# EAGLE schematic qc board V3 (EAGLE 9.6.1)
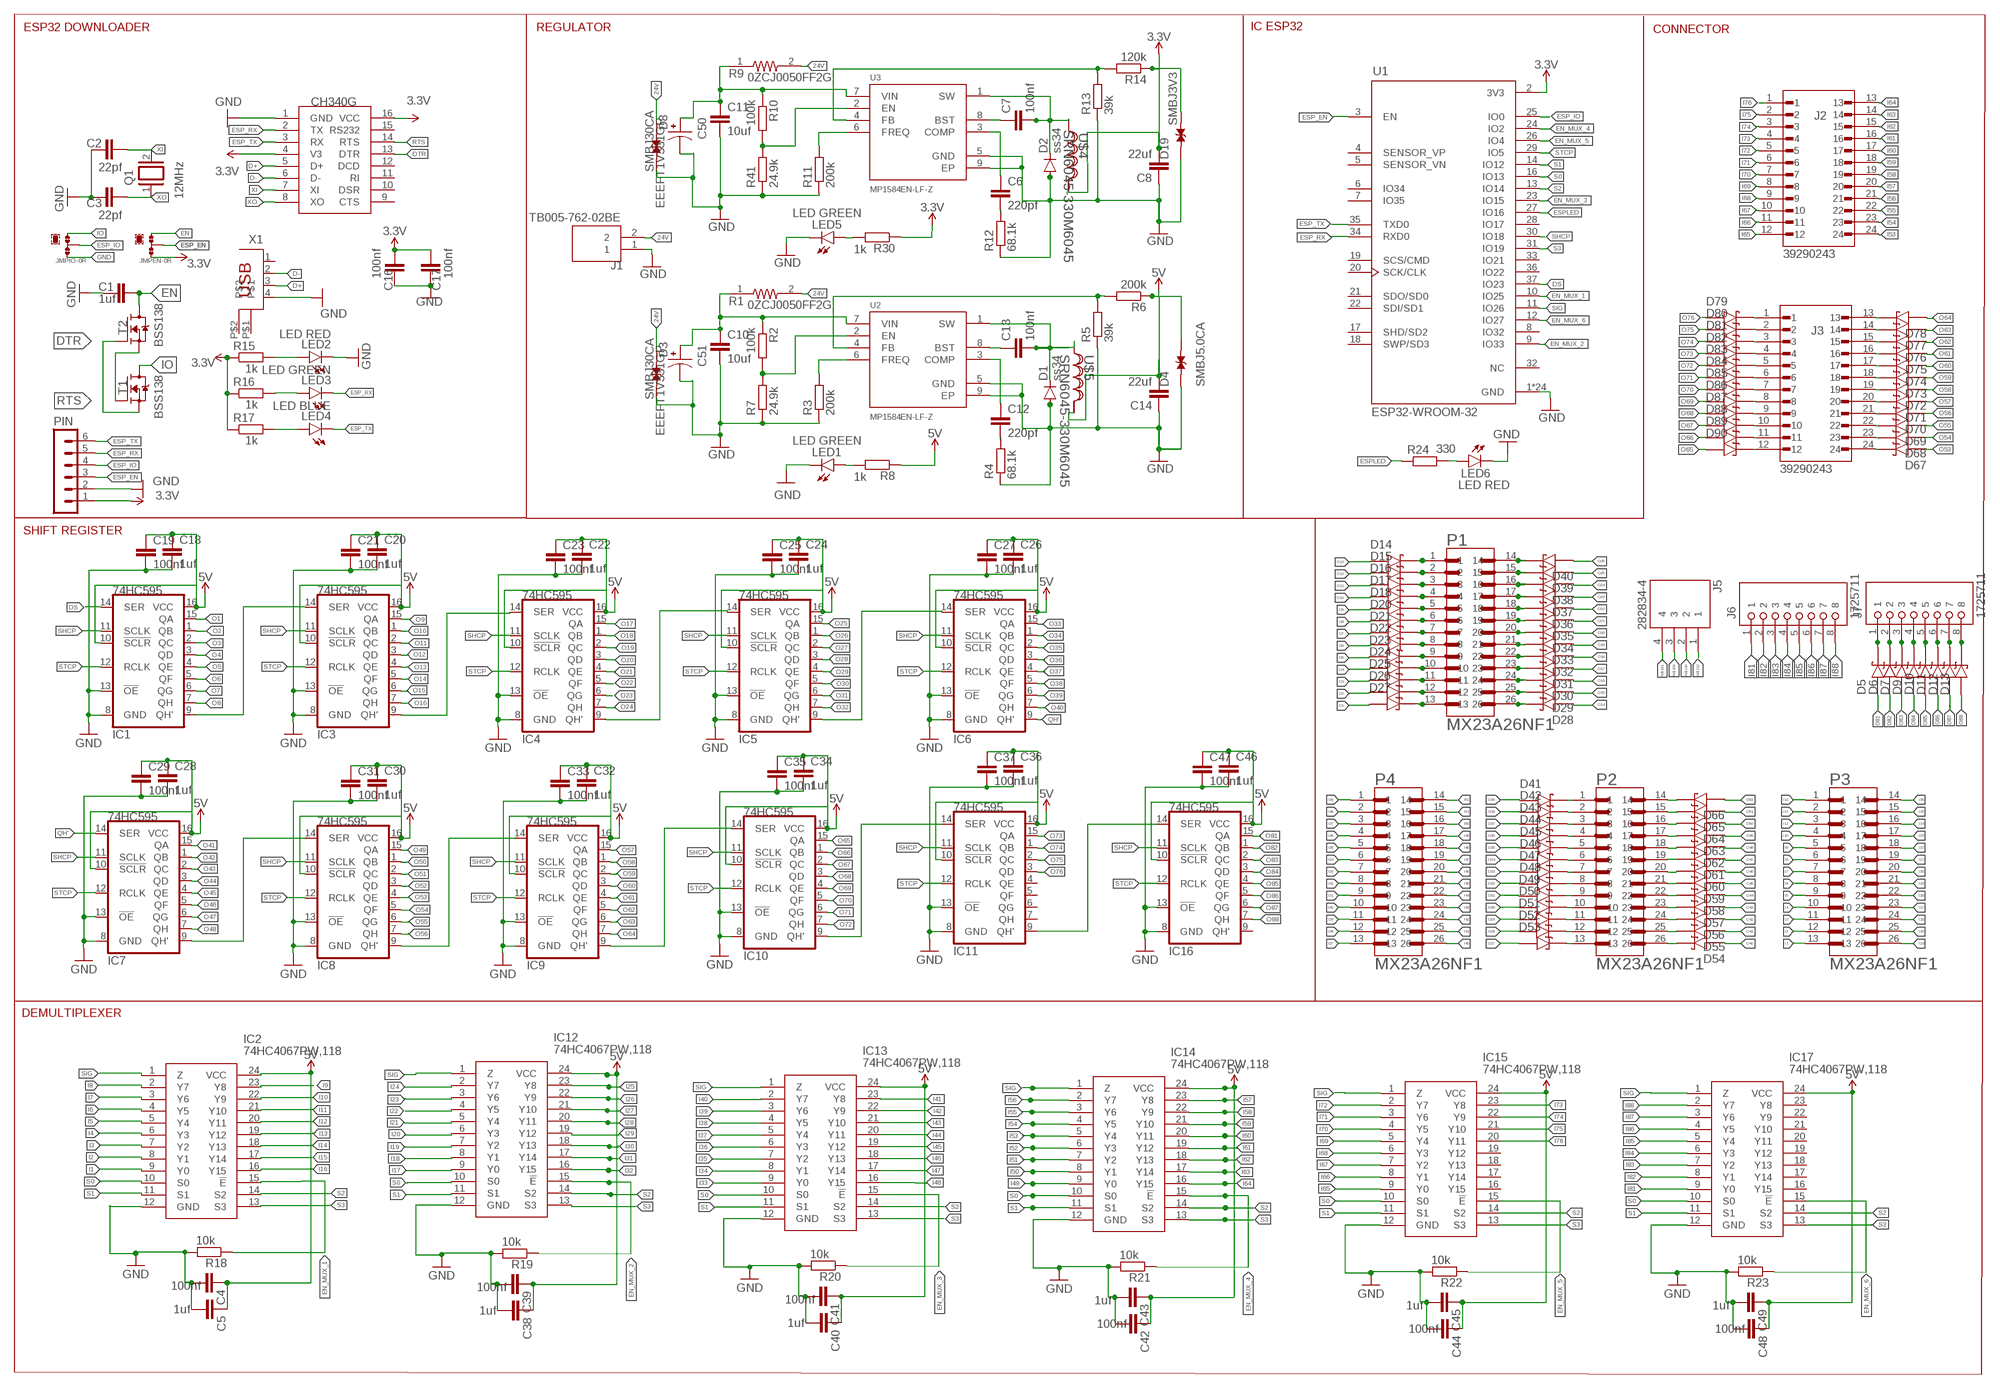
[diagram p0: schematic, sheet 1]

## Parts
C1  1uf  C-EUC0805  [C0805]
C2  22pf  C-EUC0805  [C0805]
C3  22pf  C-EUC0805  [C0805]
C4  100nf  C-EUC0805  [C0805]
C5  1uf  C-EUC0805  [C0805]
C6  220pf  C-EUC0805  [C0805]
C7  100nf  C-EUC0805  [C0805]
C8  22uf  C-EUC0805  [C0805]
C10  10uf  C-EUC0805  [C0805]
C11  10uf  C-EUC0805  [C0805]
C12  220pf  C-EUC0805  [C0805]
C13  100nf  C-EUC0805  [C0805]
C14  22uf  C-EUC0805  [C0805]
C16  100nf  C-EUC0805  [C0805]
C17  100nf  C-EUC0805  [C0805]
C18  1uf  C-EUC0805  [C0805]
C19  100nf  C-EUC0805  [C0805]
C20  1uf  C-EUC0805  [C0805]
C21  100nf  C-EUC0805  [C0805]
C22  1uf  C-EUC0805  [C0805]
C23  100nf  C-EUC0805  [C0805]
C24  1uf  C-EUC0805  [C0805]
C25  100nf  C-EUC0805  [C0805]
C26  1uf  C-EUC0805  [C0805]
C27  100nf  C-EUC0805  [C0805]
C28  1uf  C-EUC0805  [C0805]
C29  100nf  C-EUC0805  [C0805]
C30  1uf  C-EUC0805  [C0805]
C31  100nf  C-EUC0805  [C0805]
C32  1uf  C-EUC0805  [C0805]
C33  100nf  C-EUC0805  [C0805]
C34  1uf  C-EUC0805  [C0805]
C35  100nf  C-EUC0805  [C0805]
C36  1uf  C-EUC0805  [C0805]
C37  100nf  C-EUC0805  [C0805]
C38  1uf  C-EUC0805  [C0805]
C39  100nf  C-EUC0805  [C0805]
C40  1uf  C-EUC0805  [C0805]
C41  100nf  C-EUC0805  [C0805]
C42  100nf  C-EUC0805  [C0805]
C43  1uf  C-EUC0805  [C0805]
C44  100nf  C-EUC0805  [C0805]
C45  1uf  C-EUC0805  [C0805]
C46  1uf  C-EUC0805  [C0805]
C47  100nf  C-EUC0805  [C0805]
C48  100nf  C-EUC0805  [C0805]
C49  1uf  C-EUC0805  [C0805]
C50  EEEFT1V331GP  [CAP_EEEFT1V331GP]
C51  EEEFT1V331GP  [CAP_EEEFT1V331GP]
D1  ss34  DIODE-SMB  [SMB]
D2  ss34  DIODE-SMB  [SMB]
D3  SMBJ30CA  [DIOM4336X265N]
D4  SMBJ5.0CA  [DIOM4336X265N]
D5  1N5819HW-7  [SOD3715X145N]
D6  1N5819HW-7  [SOD3715X145N]
D7  1N5819HW-7  [SOD3715X145N]
D8  SMBJ30CA  [DIOM4336X265N]
D9  1N5819HW-7  [SOD3715X145N]
D10  1N5819HW-7  [SOD3715X145N]
D11  1N5819HW-7  [SOD3715X145N]
D12  1N5819HW-7  [SOD3715X145N]
D13  1N5819HW-7  [SOD3715X145N]
D14  1N5819HW-7  [SOD3715X145N]
D15  1N5819HW-7  [SOD3715X145N]
D16  1N5819HW-7  [SOD3715X145N]
D17  1N5819HW-7  [SOD3715X145N]
D18  1N5819HW-7  [SOD3715X145N]
D19  SMBJ3V3  [DIOM4336X265N]
D20  1N5819HW-7  [SOD3715X145N]
D21  1N5819HW-7  [SOD3715X145N]
D22  1N5819HW-7  [SOD3715X145N]
D23  1N5819HW-7  [SOD3715X145N]
D24  1N5819HW-7  [SOD3715X145N]
D25  1N5819HW-7  [SOD3715X145N]
D26  1N5819HW-7  [SOD3715X145N]
D27  1N5819HW-7  [SOD3715X145N]
D28  1N5819HW-7  [SOD3715X145N]
D29  1N5819HW-7  [SOD3715X145N]
D30  1N5819HW-7  [SOD3715X145N]
D31  1N5819HW-7  [SOD3715X145N]
D32  1N5819HW-7  [SOD3715X145N]
D33  1N5819HW-7  [SOD3715X145N]
D34  1N5819HW-7  [SOD3715X145N]
D35  1N5819HW-7  [SOD3715X145N]
D36  1N5819HW-7  [SOD3715X145N]
D37  1N5819HW-7  [SOD3715X145N]
D38  1N5819HW-7  [SOD3715X145N]
D39  1N5819HW-7  [SOD3715X145N]
D40  1N5819HW-7  [SOD3715X145N]
D41  1N5819HW-7  [SOD3715X145N]
D42  1N5819HW-7  [SOD3715X145N]
D43  1N5819HW-7  [SOD3715X145N]
D44  1N5819HW-7  [SOD3715X145N]
D45  1N5819HW-7  [SOD3715X145N]
D46  1N5819HW-7  [SOD3715X145N]
D47  1N5819HW-7  [SOD3715X145N]
D48  1N5819HW-7  [SOD3715X145N]
D49  1N5819HW-7  [SOD3715X145N]
D50  1N5819HW-7  [SOD3715X145N]
D51  1N5819HW-7  [SOD3715X145N]
D52  1N5819HW-7  [SOD3715X145N]
D53  1N5819HW-7  [SOD3715X145N]
D54  1N5819HW-7  [SOD3715X145N]
D55  1N5819HW-7  [SOD3715X145N]
D56  1N5819HW-7  [SOD3715X145N]
D57  1N5819HW-7  [SOD3715X145N]
D58  1N5819HW-7  [SOD3715X145N]
D59  1N5819HW-7  [SOD3715X145N]
D60  1N5819HW-7  [SOD3715X145N]
D61  1N5819HW-7  [SOD3715X145N]
D62  1N5819HW-7  [SOD3715X145N]
D63  1N5819HW-7  [SOD3715X145N]
D64  1N5819HW-7  [SOD3715X145N]
D65  1N5819HW-7  [SOD3715X145N]
D66  1N5819HW-7  [SOD3715X145N]
D67  1N5819HW-7  [SOD3715X145N]
D68  1N5819HW-7  [SOD3715X145N]
D69  1N5819HW-7  [SOD3715X145N]
D70  1N5819HW-7  [SOD3715X145N]
D71  1N5819HW-7  [SOD3715X145N]
D72  1N5819HW-7  [SOD3715X145N]
D73  1N5819HW-7  [SOD3715X145N]
D74  1N5819HW-7  [SOD3715X145N]
D75  1N5819HW-7  [SOD3715X145N]
D76  1N5819HW-7  [SOD3715X145N]
D77  1N5819HW-7  [SOD3715X145N]
D78  1N5819HW-7  [SOD3715X145N]
D79  1N5819HW-7  [SOD3715X145N]
D80  1N5819HW-7  [SOD3715X145N]
D81  1N5819HW-7  [SOD3715X145N]
D82  1N5819HW-7  [SOD3715X145N]
D83  1N5819HW-7  [SOD3715X145N]
D84  1N5819HW-7  [SOD3715X145N]
D85  1N5819HW-7  [SOD3715X145N]
D86  1N5819HW-7  [SOD3715X145N]
D87  1N5819HW-7  [SOD3715X145N]
D88  1N5819HW-7  [SOD3715X145N]
D89  1N5819HW-7  [SOD3715X145N]
D90  1N5819HW-7  [SOD3715X145N]
IC1  74HC595  [SO16]
IC2  74HC4067PW,118  [SOP65P640X110-24N]
IC3  74HC595  [SO16]
IC4  74HC595  [SO16]
IC5  74HC595  [SO16]
IC6  74HC595  [SO16]
IC7  74HC595  [SO16]
IC8  74HC595  [SO16]
IC9  74HC595  [SO16]
IC10  74HC595  [SO16]
IC11  74HC595  [SO16]
IC12  74HC4067PW,118  [SOP65P640X110-24N]
IC13  74HC4067PW,118  [SOP65P640X110-24N]
IC14  74HC4067PW,118  [SOP65P640X110-24N]
IC15  74HC4067PW,118  [SOP65P640X110-24N]
IC16  74HC595  [SO16]
IC17  74HC4067PW,118  [SOP65P640X110-24N]
J1  TB005-762-02BE  [CUI_TB005-762-02BE]
J2  39290243  [MOLEX_39290243]
J3  39290243  [MOLEX_39290243]
J5  282834-4  [TE_282834-4]
J6  1725711  [PHOENIX_1725711]
J7  1725711  [PHOENIX_1725711]
JMPEN  0R-JUMPB  [B0R-JMP]
JMPIO  0R-JUMPB  [B0R-JMP]
LED1  LED GREEN  LEDCHIP-LED0805  [CHIP-LED0805]
LED2  LED RED  LEDCHIPLED_0805  [CHIPLED_0805]
LED3  LED GREEN  LEDCHIPLED_0805  [CHIPLED_0805]
LED4  LED BLUE  LEDCHIPLED_0805  [CHIPLED_0805]
LED5  LED GREEN  LEDCHIP-LED0805  [CHIP-LED0805]
LED6  LED RED  LEDCHIP-LED0805  [CHIP-LED0805]
P1  MX23A26NF1  [JAE_MX23A26NF1]
P2  MX23A26NF1  [JAE_MX23A26NF1]
P3  MX23A26NF1  [JAE_MX23A26NF1]
P4  MX23A26NF1  [JAE_MX23A26NF1]
PIN  MA06-1  [MA06-1]
Q1  12MHz  XTAL/S  [QS]
R1  0ZCJ0050FF2G  [RESC3216X125N]
R2  100k  R-EU_R0805  [R0805]
R3  200k  R-EU_R0805  [R0805]
R4  68.1k  R-EU_R0805  [R0805]
R5  39k  R-EU_R0805  [R0805]
R6  200k  R-EU_R0805  [R0805]
R7  24.9k  R-EU_R0805  [R0805]
R8  1k  R-EU_R0805  [R0805]
R9  0ZCJ0050FF2G  [RESC3216X125N]
R10  100k  R-EU_R0805  [R0805]
R11  200k  R-EU_R0805  [R0805]
R12  68.1k  R-EU_R0805  [R0805]
R13  39k  R-EU_R0805  [R0805]
R14  120k  R-EU_R0805  [R0805]
R15  1k  R-EU_M0805  [M0805]
R16  1k  R-EU_M0805  [M0805]
R17  1k  R-EU_M0805  [M0805]
R18  10k  R-EU_M0805  [M0805]
R19  10k  R-EU_M0805  [M0805]
R20  10k  R-EU_M0805  [M0805]
R21  10k  R-EU_M0805  [M0805]
R22  10k  R-EU_M0805  [M0805]
R23  10k  R-EU_M0805  [M0805]
R24  330  R-EU_R0805  [R0805]
R30  1k  R-EU_R0805  [R0805]
R41  24.9k  R-EU_R0805  [R0805]
T1  BSS138  [SOT95P240X111-3N]
T2  BSS138  [SOT95P240X111-3N]
U1  ESP32-WROOM-32  [MODULE_ESP32-WROOM-32]
U2  MP1584EN-LF-Z  [SOIC127P600X170-9N]
U3  MP1584EN-LF-Z  [SOIC127P600X170-9N]
U$3  CH340G  [SOIC16]
U$4  SRN6045-330M6045  [SRN6045]
U$5  SRN6045-330M6045  [SRN6045]
X1  PN61729  [PN61729]

## Nets
3.3V: C8.2 C16.1 C17.1 D19.2 JMPEN.3 PIN.1 R14.1 R15.1 R16.1 R17.1 R30.1 U1.2(3V3) U$3.4(V3) U$3.16(VCC) U$4.1
5V: C4.1 C5.1 C14.2 C18.1 C19.1 C20.1 C21.1 C22.1 C23.1 C24.1 C25.1 C26.1 C27.1 C28.1 C29.1 C30.1 C31.1 C32.1 C33.1 C34.1 C35.1 C36.1 C37.1 C38.1 C39.1 C40.1 C41.1 C42.1 C43.1 C44.1 C45.1 C46.1 C47.1 C48.1 C49.1 D4.2 IC1.10(!SCLR) IC1.16(VCC) IC2.24(VCC) IC3.10(!SCLR) IC3.16(VCC) IC4.10(!SCLR) IC4.16(VCC) IC5.10(!SCLR) IC5.16(VCC) IC6.10(!SCLR) IC6.16(VCC) IC7.10(!SCLR) IC7.16(VCC) IC8.10(!SCLR) IC8.16(VCC) IC9.10(!SCLR) IC9.16(VCC) IC10.10(!SCLR) IC10.16(VCC) IC11.10(!SCLR) IC11.16(VCC) IC12.24(VCC) IC13.24(VCC) IC14.24(VCC) IC15.24(VCC) IC16.10(!SCLR) IC16.16(VCC) IC17.24(VCC) R6.1 R8.1 U$5.1
24V: D3.1 D8.1 J1.2 R1.2 R9.2
D+: U$3.5(D+) X1.3
D-: U$3.6(D-) X1.2
DS: IC1.14(SER) U1.37(IO23)
DTR: T1.2(S) T2.1(G) U$3.13(DTR)
EN: C1.1 JMPEN.1 T2.3(D)
EN_MUX_1: IC2.15(!E) R18.1 U1.10(IO25)
EN_MUX_2: IC12.15(!E) R19.1 U1.9(IO33)
EN_MUX_3: IC13.15(!E) R20.1 U1.23(IO15)
EN_MUX_4: IC14.15(!E) R21.1 U1.24(IO2)
EN_MUX_5: IC15.15(!E) R22.1 U1.26(IO4)
EN_MUX_6: IC17.15(!E) R23.1 U1.12(IO27)
ESP_EN: JMPEN.2 PIN.3 U1.3(EN)
ESP_IO: JMPIO.2 PIN.4 U1.25(IO0)
ESP_RX: LED3.C PIN.5 U1.34(RXD0) U$3.2(TX)
ESP_TX: LED4.C PIN.6 U1.35(TXD0) U$3.3(RX)
ESPLED: R24.1 U1.27(IO16)
GND: C1.2 C2.2 C3.2 C4.2 C5.2 C8.1 C10.2 C11.2 C14.1 C16.2 C17.2 C18.2 C19.2 C20.2 C21.2 C22.2 C23.2 C24.2 C25.2 C26.2 C27.2 C28.2 C29.2 C30.2 C31.2 C32.2 C33.2 C34.2 C35.2 C36.2 C37.2 C38.2 C39.2 C40.2 C41.2 C42.2 C43.2 C44.2 C45.2 C46.2 C47.2 C48.2 C49.2 C50.2 C51.2 D1.A D2.A D3.2 D4.1 D8.2 D19.1 IC1.8(GND) IC1.13(!OE) IC2.12(GND) IC3.8(GND) IC3.13(!OE) IC4.8(GND) IC4.13(!OE) IC5.8(GND) IC5.13(!OE) IC6.8(GND) IC6.13(!OE) IC7.8(GND) IC7.13(!OE) IC8.8(GND) IC8.13(!OE) IC9.8(GND) IC9.13(!OE) IC10.8(GND) IC10.13(!OE) IC11.8(GND) IC11.13(!OE) IC12.12(GND) IC13.12(GND) IC14.12(GND) IC15.12(GND) IC16.8(GND) IC16.13(!OE) IC17.12(GND) J1.1 JMPIO.3 LED1.C LED2.C LED5.C LED6.C PIN.2 R3.1 R4.1 R5.1 R7.1 R11.1 R12.1 R13.1 R18.2 R19.2 R20.2 R21.2 R22.2 R23.2 R41.1 U1.1(GND) U1.15(GND) U1.38(GND) U1.39_1(GND) U1.39_2(GND) U1.39_3(GND) U1.39_4(GND) U1.39_5(GND) U1.39_6(GND) U1.39_7(GND) U1.39_8(GND) U1.39_9(GND) U1.39_10(GND) U1.39_11(GND) U1.39_12(GND) U1.39_13(GND) U1.39_14(GND) U1.39_15(GND) U1.39_16(GND) U1.39_17(GND) U1.39_18(GND) U1.39_19(GND) U1.39_20(GND) U1.39_21(GND) U2.5(GND) U2.9(EP) U3.5(GND) U3.9(EP) U$3.1(GND) X1.4
I1: IC2.9(Y0) P3.13
I2: IC2.8(Y1) P3.12
I3: IC2.7(Y2) P3.11
I4: IC2.6(Y3) P3.10
I5: IC2.5(Y4) P3.9
I6: IC2.4(Y5) P3.8
I7: IC2.3(Y6) P3.7
I8: IC2.2(Y7) P3.6
I9: IC2.23(Y8) P3.5
I10: IC2.22(Y9) P3.4
I11: IC2.21(Y10) P3.3
I12: IC2.20(Y11) P3.2
I13: IC2.19(Y12) P3.1
I14: IC2.18(Y13) P3.26
I15: IC2.17(Y14) P3.25
I16: IC2.16(Y15) P3.24
I17: IC12.9(Y0) P3.23
I18: IC12.8(Y1) P3.22
I19: IC12.7(Y2) P3.21
I20: IC12.6(Y3) P3.20
I21: IC12.5(Y4) P3.19
I22: IC12.4(Y5) P3.18
I23: IC12.3(Y6) P3.17
I24: IC12.2(Y7) P3.16
I25: IC12.23(Y8) P3.15
I26: IC12.22(Y9) P3.14
I27: IC12.21(Y10) P4.13
I28: IC12.20(Y11) P4.12
I29: IC12.19(Y12) P4.11
I30: IC12.18(Y13) P4.10
I31: IC12.17(Y14) P4.9
I32: IC12.16(Y15) P4.8
I33: IC13.9(Y0) P4.7
I34: IC13.8(Y1) P4.6
I35: IC13.7(Y2) P4.5
I36: IC13.6(Y3) P4.4
I37: IC13.5(Y4) P4.3
I38: IC13.4(Y5) P4.2
I39: IC13.3(Y6) P4.1
I40: IC13.2(Y7) P4.26
I41: IC13.23(Y8) P4.25
I42: IC13.22(Y9) P4.24
I43: IC13.21(Y10) P4.23
I44: IC13.20(Y11) P4.22
I45: IC13.19(Y12) P4.21
I46: IC13.18(Y13) P4.20
I47: IC13.17(Y14) P4.19
I48: IC13.16(Y15) P4.18
I49: IC14.9(Y0) P4.17
I50: IC14.8(Y1) P4.16
I51: IC14.7(Y2) P4.15
I52: IC14.6(Y3) P4.14
I53: IC14.5(Y4) J2.24
I54: IC14.4(Y5) J2.23
I55: IC14.3(Y6) J2.22
I56: IC14.2(Y7) J2.21
I57: IC14.23(Y8) J2.20
I58: IC14.22(Y9) J2.19
I59: IC14.21(Y10) J2.18
I60: IC14.20(Y11) J2.17
I61: IC14.19(Y12) J2.16
I62: IC14.18(Y13) J2.15
I63: IC14.17(Y14) J2.14
I64: IC14.16(Y15) J2.13
I65: IC15.9(Y0) J2.12
I66: IC15.8(Y1) J2.11
I67: IC15.7(Y2) J2.10
I68: IC15.6(Y3) J2.9
I69: IC15.5(Y4) J2.8
I70: IC15.4(Y5) J2.7
I71: IC15.3(Y6) J2.6
I72: IC15.2(Y7) J2.5
I73: IC15.23(Y8) J2.4
I74: IC15.22(Y9) J2.3
I75: IC15.21(Y10) J2.2
I76: IC15.20(Y11) J2.1
I81: IC17.9(Y0) J6.1
I82: IC17.8(Y1) J6.2
I83: IC17.7(Y2) J6.3
I84: IC17.6(Y3) J6.4
I85: IC17.5(Y4) J6.5
I86: IC17.4(Y5) J6.6
I87: IC17.3(Y6) J6.7
I88: IC17.2(Y7) J6.8
IO: JMPIO.1 T1.3(D)
N$1: R10.2 R41.2 U3.2(EN)
N$2: R3.2 U2.6(FREQ)
N$3: R11.2 U3.6(FREQ)
N$4: C7.1 U3.8(BST)
N$5: C7.2 D2.C U3.1(SW) U$4.2
N$6: C13.1 U2.8(BST)
N$7: C6.2 R12.2
N$8: C6.1 U3.3(COMP)
N$9: LED5.A R30.2
N$10: R13.2 R14.2 U3.4(FB)
N$12: C13.2 D1.C U2.1(SW) U$5.2
N$13: R5.2 R6.2 U2.4(FB)
N$14: C12.2 R4.2
N$15: R2.2 R7.2 U2.2(EN)
N$16: C12.1 U2.3(COMP)
N$17: LED1.A R8.2
N$19: LED2.A R15.2
N$20: LED3.A R16.2
N$21: LED4.A R17.2
N$22: IC11.9(QH') IC16.14(SER)
N$23: D5.C(K) J7.1
N$24: D6.C(K) J7.2
N$25: D7.C(K) J7.3
N$26: D9.C(K) J7.4
N$27: D10.C(K) J7.5
N$28: D11.C(K) J7.6
N$29: D12.C(K) J7.7
N$30: IC1.9(QH') IC3.14(SER)
N$31: IC3.9(QH') IC4.14(SER)
N$32: IC4.9(QH') IC5.14(SER)
N$33: IC5.9(QH') IC6.14(SER)
N$34: IC7.9(QH') IC8.14(SER)
N$35: IC8.9(QH') IC9.14(SER)
N$36: IC9.9(QH') IC10.14(SER)
N$37: IC10.9(QH') IC11.14(SER)
N$38: D13.C(K) J7.8
N$39: D14.C(K) P1.1
N$40: D15.C(K) P1.2
N$41: D16.C(K) P1.3
N$42: D17.C(K) P1.4
N$43: D18.C(K) P1.5
N$44: D20.C(K) P1.6
N$45: D21.C(K) P1.7
N$46: D22.C(K) P1.8
N$47: D23.C(K) P1.9
N$48: D24.C(K) P1.10
N$49: D25.C(K) P1.11
N$50: D26.C(K) P1.12
N$51: D27.C(K) P1.13
N$52: D40.C(K) P1.14
N$53: D39.C(K) P1.15
N$54: D38.C(K) P1.16
N$55: D37.C(K) P1.17
N$56: D36.C(K) P1.18
N$57: D35.C(K) P1.19
N$58: D34.C(K) P1.20
N$59: D33.C(K) P1.21
N$60: D32.C(K) P1.22
N$61: D31.C(K) P1.23
N$62: D30.C(K) P1.24
N$63: D29.C(K) P1.25
N$64: D28.C(K) P1.26
N$65: D41.C(K) P2.1
N$66: D42.C(K) P2.2
N$67: D43.C(K) P2.3
N$68: D44.C(K) P2.4
N$69: D45.C(K) P2.5
N$70: D46.C(K) P2.6
N$71: D47.C(K) P2.7
N$72: D48.C(K) P2.8
N$73: D49.C(K) P2.9
N$74: D50.C(K) P2.10
N$75: D51.C(K) P2.11
N$76: D52.C(K) P2.12
N$77: D53.C(K) P2.13
N$78: D69.C(K) J3.22
N$79: D68.C(K) J3.23
N$80: D66.C(K) P2.14
N$81: D65.C(K) P2.15
N$82: D64.C(K) P2.16
N$83: D63.C(K) P2.17
N$84: D62.C(K) P2.18
N$85: D61.C(K) P2.19
N$86: D60.C(K) P2.20
N$87: D59.C(K) P2.21
N$88: D58.C(K) P2.22
N$89: D57.C(K) P2.23
N$90: D56.C(K) P2.24
N$91: D55.C(K) P2.25
N$92: D54.C(K) P2.26
N$93: D67.C(K) J3.24
N$94: D70.C(K) J3.21
N$95: D78.C(K) J3.13
N$96: D77.C(K) J3.14
N$97: D76.C(K) J3.15
N$98: D75.C(K) J3.16
N$99: D74.C(K) J3.17
N$100: D73.C(K) J3.18
N$101: D72.C(K) J3.19 J5.4
N$102: D71.C(K) J3.20
N$103: D79.C(K) J3.1
N$104: D80.C(K) J3.2
N$105: D81.C(K) J3.3
N$106: D82.C(K) J3.4
N$107: D83.C(K) J3.5
N$108: D84.C(K) J3.6
N$109: D85.C(K) J3.7 J5.3
N$110: D86.C(K) J3.8 J5.2
N$111: D87.C(K) J3.9
N$112: D88.C(K) J3.10 J5.1
N$113: D89.C(K) J3.11
N$114: D90.C(K) J3.12
N$116: LED6.A R24.2
O1: D27.A IC1.15(QA)
O2: D26.A IC1.1(QB)
O3: D25.A IC1.2(QC)
O4: D24.A IC1.3(QD)
O5: D23.A IC1.4(QE)
O6: D22.A IC1.5(QF)
O7: D21.A IC1.6(QG)
O8: D20.A IC1.7(QH)
O9: D18.A IC3.15(QA)
O10: D17.A IC3.1(QB)
O11: D16.A IC3.2(QC)
O12: D15.A IC3.3(QD)
O13: D14.A IC3.4(QE)
O14: D28.A IC3.5(QF)
O15: D29.A IC3.6(QG)
O16: D30.A IC3.7(QH)
O17: D31.A IC4.15(QA)
O18: D32.A IC4.1(QB)
O19: D33.A IC4.2(QC)
O20: D34.A IC4.3(QD)
O21: D35.A IC4.4(QE)
O22: D36.A IC4.5(QF)
O23: D37.A IC4.6(QG)
O24: D38.A IC4.7(QH)
O25: D39.A IC5.15(QA)
O26: D40.A IC5.1(QB)
O27: D53.A IC5.2(QC)
O28: D52.A IC5.3(QD)
O29: D51.A IC5.4(QE)
O30: D50.A IC5.5(QF)
O31: D49.A IC5.6(QG)
O32: D48.A IC5.7(QH)
O33: D47.A IC6.15(QA)
O34: D46.A IC6.1(QB)
O35: D45.A IC6.2(QC)
O36: D44.A IC6.3(QD)
O37: D43.A IC6.4(QE)
O38: D42.A IC6.5(QF)
O39: D41.A IC6.6(QG)
O40: D54.A IC6.7(QH)
O41: D55.A IC7.15(QA)
O42: D56.A IC7.1(QB)
O43: D57.A IC7.2(QC)
O44: D58.A IC7.3(QD)
O45: D59.A IC7.4(QE)
O46: D60.A IC7.5(QF)
O47: D61.A IC7.6(QG)
O48: D62.A IC7.7(QH)
O49: D63.A IC8.15(QA)
O50: D64.A IC8.1(QB)
O51: D65.A IC8.2(QC)
O52: D66.A IC8.3(QD)
O53: D67.A IC8.4(QE)
O54: D68.A IC8.5(QF)
O55: D69.A IC8.6(QG)
O56: D70.A IC8.7(QH)
O57: D71.A IC9.15(QA)
O58: D72.A IC9.1(QB)
O59: D73.A IC9.2(QC)
O60: D74.A IC9.3(QD)
O61: D75.A IC9.4(QE)
O62: D76.A IC9.5(QF)
O63: D77.A IC9.6(QG)
O64: D78.A IC9.7(QH)
O65: D90.A IC10.15(QA)
O66: D89.A IC10.1(QB)
O67: D88.A IC10.2(QC)
O68: D87.A IC10.3(QD)
O69: D86.A IC10.4(QE)
O70: D85.A IC10.5(QF)
O71: D84.A IC10.6(QG)
O72: D83.A IC10.7(QH)
O73: D82.A IC11.15(QA)
O74: D81.A IC11.1(QB)
O75: D80.A IC11.2(QC)
O76: D79.A IC11.3(QD)
O81: D5.A IC16.15(QA)
O82: D6.A IC16.1(QB)
O83: D7.A IC16.2(QC)
O84: D9.A IC16.3(QD)
O85: D10.A IC16.4(QE)
O86: D11.A IC16.5(QF)
O87: D12.A IC16.6(QG)
O88: D13.A IC16.7(QH)
OUT_FUSE: C11.1 C50.1 R9.1 R10.1 U3.7(VIN)
OUT_FUSE1: C10.1 C51.1 R1.1 R2.1 U2.7(VIN)
QH': IC6.9(QH') IC7.14(SER)
RTS: T1.1(G) T2.2(S) U$3.14(RTS)
S0: IC2.10(S0) IC12.10(S0) IC13.10(S0) IC14.10(S0) IC15.10(S0) IC17.10(S0) U1.16(IO13)
S1: IC2.11(S1) IC12.11(S1) IC13.11(S1) IC14.11(S1) IC15.11(S1) IC17.11(S1) U1.14(IO12)
S2: IC2.14(S2) IC12.14(S2) IC13.14(S2) IC14.14(S2) IC15.14(S2) IC17.14(S2) U1.13(IO14)
S3: IC2.13(S3) IC12.13(S3) IC13.13(S3) IC14.13(S3) IC15.13(S3) IC17.13(S3) U1.31(IO19)
SHCP: IC1.11(SCLK) IC3.11(SCLK) IC4.11(SCLK) IC5.11(SCLK) IC6.11(SCLK) IC7.11(SCLK) IC8.11(SCLK) IC9.11(SCLK) IC10.11(SCLK) IC11.11(SCLK) IC16.11(SCLK) U1.30(IO18)
SIG: IC2.1(Z) IC12.1(Z) IC13.1(Z) IC14.1(Z) IC15.1(Z) IC17.1(Z) U1.11(IO26)
STCP: IC1.12(RCLK) IC3.12(RCLK) IC4.12(RCLK) IC5.12(RCLK) IC6.12(RCLK) IC7.12(RCLK) IC8.12(RCLK) IC9.12(RCLK) IC10.12(RCLK) IC11.12(RCLK) IC16.12(RCLK) U1.29(IO5)
XI: C2.1 Q1.2 U$3.7(XI)
XO: C3.1 Q1.1 U$3.8(XO)
Unconnected: IC11.4(QE) IC11.5(QF) IC11.6(QG) IC11.7(QH) IC15.16(Y15) IC15.17(Y14) IC15.18(Y13) IC15.19(Y12) IC16.9(QH') IC17.16(Y15) IC17.17(Y14) IC17.18(Y13) IC17.19(Y12) IC17.20(Y11) IC17.21(Y10) IC17.22(Y9) IC17.23(Y8) U1.4(SENSOR_VP) U1.5(SENSOR_VN) U1.6(IO34) U1.7(IO35) U1.8(IO32) U1.17(SHD/SD2) U1.18(SWP/SD3) U1.19(SCS/CMD) U1.20(SCK/CLK) U1.21(SDO/SD0) U1.22(SDI/SD1) U1.28(IO17) U1.32(NC) U1.33(IO21) U1.36(IO22) U$3.9(CTS) U$3.10(DSR) U$3.11(RI) U$3.12(DCD) U$3.15(RS232) X1.1 X1.P$1 X1.P$2

## Notes on the sheet
- ESP32 DOWNLOADER | REGULATOR | IC ESP32 | CONNECTOR
- SHIFT REGISTER
- DEMULTIPLEXER

## Library data of the parts
C1-C8 C10-C14 C16-C49 = rcl:C-EU: CAPACITOR, European symbol; SPICEPREFIX: C
C50 C51 = EEEFT1V331GP:EEEFT1V331GP: Check availability <https://pricing.snapeda.com/parts/EEEFT1V331GP/Panasonic/view-part?ref=eda>; AVAILABILITY: In Stock; CHECK_PRICES: https://www.snapeda.com/parts/EEEFT1V331GP/Panasonic/view-part/?ref=eda; DESCRIPTION: Cap Aluminum Lytic 330uF 35V 20% (8 X 10.2mm) SMD 0.08 Ohm 850mA 5000h 105°C Automotive T/R; MF: Panasonic; MP: EEEFT1V331GP; PACKAGE: RADIAL-2 Panasonic; PRICE: None; SNAPEDA_LINK: https://www.snapeda.com/parts/EEEFT1V331GP/Panasonic/view-part/?ref=snap
D1 D2 = diode:DIODE-: DIODE
D3 D8 = SMBJ30CA:SMBJ30CA: Check availability <https://pricing.snapeda.com/parts/SMBJ30CA/Taiwan%20Semiconductor%20Corporation/view-part?ref=eda>; AVAILABILITY: In Stock; CHECK_PRICES: https://www.snapeda.com/parts/SMBJ30CA/Taiwan+Semiconductor/view-part/?ref=eda; DESCRIPTION: 600W, 35.1V, 5%, Bidirectional, TVS; MF: Taiwan Semiconductor Corporation; MP: SMBJ30CA; PACKAGE: SMB Taiwan Semiconductor; PRICE: None; SNAPEDA_LINK: https://www.snapeda.com/parts/SMBJ30CA/Taiwan+Semiconductor/view-part/?ref=snap
D4 = SMBJ5.0CA:SMBJ5.0CA: Check availability <https://pricing.snapeda.com/parts/SMBJ5.0CA/Taiwan%20Semiconductor/view-part?ref=eda>; AVAILABILITY: In Stock; CHECK_PRICES: https://www.snapeda.com/parts/SMBJ5.0CA/taiwan/view-part/?ref=eda; DESCRIPTION: 600W, 6.7V, 5%, Bidirectional, TVS; MF: Taiwan Semiconductor; MP: SMBJ5.0CA; PACKAGE: SMB Taiwan Semiconductor; PRICE: None; SNAPEDA_LINK: https://www.snapeda.com/parts/SMBJ5.0CA/taiwan/view-part/?ref=snap
D5-D7 D9-D18 D20-D90 = 1N5819HW-7:1N5819HW-7: Check availability <https://pricing.snapeda.com/parts/1N5819HW-7/Diodes%20Inc./view-part?ref=eda>; AVAILABILITY: In Stock; CHECK_PRICES: https://www.snapeda.com/parts/1N5819HW-7/Diodes+Inc./view-part/?ref=eda; DESCRIPTION: Diode Schottky 40 V 1A Surface Mount SOD-123; MF: Diodes Inc.; MP: 1N5819HW-7; PACKAGE: SOD-123 Fairchild Semiconductor; PRICE: None; SNAPEDA_LINK: https://www.snapeda.com/parts/1N5819HW-7/Diodes+Inc./view-part/?ref=snap
D19 = SMBJ3V3:SMBJ3V3: Check availability <https://pricing.snapeda.com/parts/SMBJ30CA/Taiwan%20Semiconductor%20Corporation/view-part?ref=eda>; AVAILABILITY: In Stock; CHECK_PRICES: https://www.snapeda.com/parts/SMBJ30CA/Taiwan+Semiconductor/view-part/?ref=eda; DESCRIPTION: 600W, 35.1V, 5%, Bidirectional, TVS; MF: Taiwan Semiconductor Corporation; MP: SMBJ30CA; PACKAGE: SMB Taiwan Semiconductor; PRICE: None; SNAPEDA_LINK: https://www.snapeda.com/parts/SMBJ30CA/Taiwan+Semiconductor/view-part/?ref=snap
IC1 IC3-IC11 IC16 = 74HC595:74HC595: Check availability <https://pricing.snapeda.com/parts/74HC595/Nexperia/view-part?ref=eda>; AVAILABILITY: Not in stock; CHECK_PRICES: https://www.snapeda.com/parts/74HC595/Nexperia/view-part/?ref=eda; DESCRIPTION: Shift Register Single 8-Bit Serial to Serial/Parallel 16-Pin SSOP T/R; MF: Nexperia; MP: 74HC595; PACKAGE: None; PRICE: None; SNAPEDA_LINK: https://www.snapeda.com/parts/74HC595/Nexperia/view-part/?ref=snap
IC2 IC12-IC15 IC17 = 74HC4067PW_118:74HC4067PW,118: 74HC(T)4067 - 16-channel analog multiplexer/demultiplexer@en-us Source: Datasheet <https://assets.nexperia.com/documents/data-sheet/74HC_HCT4067.pdf>; ARROW_PART_NUMBER: 74HC4067PW,118; ARROW_PRICE-STOCK: https://www.arrow.com/en/products/74hc4067pw118/nexperia?utm_currency=USD&region=nac; DESCRIPTION: 74HC(T)4067 - 16-channel analog multiplexer/demultiplexer@en-us; HEIGHT: 1.1mm; MANUFACTURER_NAME: Nexperia; MANUFACTURER_PART_NUMBER: 74HC4067PW,118; MOUSER_PART_NUMBER: 771-74HC4067PW-T; MOUSER_PRICE-STOCK: https://www.mouser.co.uk/ProductDetail/Nexperia/74HC4067PW118?qs=P62ublwmbi9BArRi%252BuDUjA%3D%3D
J1 = TB005-762-02BE:TB005-762-02BE: Check availability <https://pricing.snapeda.com/parts/TB005-762-02BE/Same%20Sky/view-part?ref=eda>; AVAILABILITY: In Stock; CHECK_PRICES: https://www.snapeda.com/parts/TB005-762-02BE/Same+Sky/view-part/?ref=eda; DESCRIPTION: 2~24 Poles, Screw Type, Horizontal, 7.62 Pitch, 26~10 (AWG), Terminal Block Connector; MF: Same Sky; MP: TB005-762-02BE; PACKAGE: None; PRICE: None; SNAPEDA_LINK: https://www.snapeda.com/parts/TB005-762-02BE/Same+Sky/view-part/?ref=snap
J2 J3 = 39290243:39290243: Connector Header Through Hole 24 position 0.165in (4.20mm) Check availability <https://pricing.snapeda.com/parts/39-29-0243/Molex%20Connector/view-part?ref=eda>; AVAILABILITY: In Stock; CHECK_PRICES: https://www.snapeda.com/parts/39-29-0243/Molex+Connector+Corporation/view-part/?ref=eda; DESCRIPTION: .165 mini fit jr. dual row w/o peg 24 circuits | Molex Incorporated 39-29-0243; MF: Molex Connector; MP: 39-29-0243; PACKAGE: None; PRICE: None; PURCHASE-URL: https://www.snapeda.com/api/url_track_click_mouser/?unipart_id=2773376&manufacturer=Molex Connector&part_name=39-29-0243&search_term=39290243; SNAPEDA_LINK: https://www.snapeda.com/parts/39-29-0243/Molex+Connector+Corporation/view-part/?ref=snap
J5 = 282834-4:282834-4: Check availability <https://pricing.snapeda.com/parts/282834-4/TE%20Connectivity/view-part?ref=eda>; AVAILABILITY: In Stock; CENTERLINE_PITCH: 2.54 mm[.1 in]; CHECK_PRICES: https://www.snapeda.com/parts/282834-4/TE+Connectivity+AMP+Connectors/view-part/?ref=eda; COMMENT: 282834-4; DESCRIPTION: Conn; Term Blk; PCB; Wire Receptacle; 4; 2.54mm; 30-16AWG; Green; 10A;150V; M1.6 | TE Connectivity 282834-4; EU_ROHS_COMPLIANCE: Compliant with Exemptions; MF: TE Connectivity; MP: 282834-4; NUMBER_OF_POSITIONS: 4; PACKAGE: None; PRICE: None; SNAPEDA_LINK: https://www.snapeda.com/parts/282834-4/TE+Connectivity+AMP+Connectors/view-part/?ref=snap
J6 J7 = 1725711:1725711: Check availability <https://pricing.snapeda.com/parts/1725711/Phoenix%20Contact/view-part?ref=eda>; AVAILABILITY: In Stock; CHECK_PRICES: https://www.snapeda.com/parts/1725711/Phoenix+Contact/view-part/?ref=eda; DESCRIPTION: PCB Terminal Screw 2.54mm 20AWG 160V 6A 8 Position COMBICON MPT Series | Phoenix Contact 1725711; MF: Phoenix Contact; MP: 1725711; PACKAGE: None; PRICE: None; SNAPEDA_LINK: https://www.snapeda.com/parts/1725711/Phoenix+Contact/view-part/?ref=snap
JMPEN JMPIO = jump-0r-smd:0R-JUMP: SMD 0R 0805 Jumper
LED1-LED6 = led:LED: LED OSRAM: - CHIPLED LG R971, LG N971, LY N971, LG Q971, LY Q971, LO R971, LY R971 LH N974, LH R974 LS Q976, LO Q976, LY Q976 LO Q996 - Hyper CHIPLED LW Q18S LB Q993, LB Q99A, LB R99A - SideLED LS A670, LO A670, LY A670, LG A670, LP A670 LB A673, LV A673, LT A673, LW A673 LH A674 LY A675 LS A676, LA A676, LO A676, LY A676, LW A676 LS A679, LY A679, LG A679 - Hyper Micro SIDELED® LS Y876, LA Y876, LO Y876, LY Y876 LT Y87S - SmartLED LW L88C, LW L88S LB L89C, LB L89S, LG L890 LS L89K, LO L89K, LY L89K LS L896, LA L896, LO L896, LY L896 - TOPLED LS T670, LO T670, LY T670, LG T670, LP T670 LSG T670, LSP T670, LSY T670, LOP T670, LYG T670 LG T671, LOG T671, LSG T671 LB T673, LV T673, LT T673, LW T673 LH T674 LS T676, LA T676, LO T676, LY T676, LB T676, LH T676, LSB T676, LW T676 LB T67C, LV T67C, LT T67C, LS T67K, LO T67K, LY T67K, LW E67C LS E67B, LA E67B, LO E67B, LY E67B, LB E67C, LV E67C, LT E67C LW T67C LS T679, LY T679, LG T679 LS T770, LO T770, LY T770, LG T770, LP T770 LB T773, LV T773, LT T773, LW T773 LH T774 LS E675, LA E675, LY E675, LS T675 LS T776, LA T776, LO T776, LY T776, LB T776 LHGB T686 LT T68C, LB T68C - Hyper Mini TOPLED® LB M676 - Mini TOPLED Santana® LG M470 LS M47K, LO M47K, LY M47K Source: http://www.osram.convergy.de LUXEON: - LUMILED® LXK2-PW12-R00, LXK2-PW12-S00, LXK2-PW14-U00, LXK2-PW14-V00 LXK2-PM12-R00, LXK2-PM12-S00, LXK2-PM14-U00 LXK2-PE12-Q00, LXK2-PE12-R00, LXK2-PE12-S00, LXK2-PE14-T00, LXK2-PE14-U00 LXK2-PB12-K00, LXK2-PB12-L00, LXK2-PB12-M00, LXK2-PB14-N00, LXK2-PB14-P00, LXK2-PB14-Q00 LXK2-PR12-L00, LXK2-PR12-M00, LXK2-PR14-Q00, LXK2-PR14-R00 LXK2-PD12-Q00, LXK2-PD12-R00, LXK2-PD12-S00 LXK2-PH12-R00, LXK2-PH12-S00 LXK2-PL12-P00, LXK2-PL12-Q00, LXK2-PL12-R00 Source: www.luxeon.com KINGBRIGHT: KA-3528ASYC Source: www.kingbright.com
P1-P4 = MX23A26NF1:MX23A26NF1: Check availability <https://pricing.snapeda.com/parts/MX23A26NF1/JAE%20Electronics/view-part?ref=eda>; AVAILABILITY: In Stock; CHECK_PRICES: https://www.snapeda.com/parts/MX23A26NF1/JAE+Electronics/view-part/?ref=eda; DESCRIPTION: WATERPROOF BOARD TO CABLE, MX23A SERIES 26 POSITION PIN HEADER | JAE Electronics Inc. MX23A26NF1; MF: JAE Electronics; MP: MX23A26NF1; PACKAGE: None; PRICE: None; SNAPEDA_LINK: https://www.snapeda.com/parts/MX23A26NF1/JAE+Electronics/view-part/?ref=snap
PIN = con-lstb:MA06-1: PIN HEADER; OC_FARNELL: unknown; OC_NEWARK: unknown
Q1 = special:XTAL/S: CRYSTAL
R1 R9 = 0ZCJ0050FF2G:0ZCJ0050FF2G: PTC Resettable Fuse100A 8VDC T/R Check availability <https://pricing.snapeda.com/parts/0ZCJ0050FF2G/Bel%20Fuse/view-part?ref=eda>; AVAILABILITY: In Stock; CHECK_PRICES: https://www.snapeda.com/parts/0ZCJ0050FF2G/Bel+Fuse+Inc./view-part/?ref=eda; DESCRIPTION: 1206 SMT PPTC | 0.50 Ih | 8V; MF: Bel Fuse; MP: 0ZCJ0050FF2G; PACKAGE: 1206 Bel Fuse; PRICE: None; PURCHASE-URL: https://www.snapeda.com/api/url_track_click_mouser/?unipart_id=447541&manufacturer=Bel Fuse&part_name=0ZCJ0050FF2G&search_term=0zcj0050ff2g; SNAPEDA_LINK: https://www.snapeda.com/parts/0ZCJ0050FF2G/Bel+Fuse+Inc./view-part/?ref=snap
R2-R8 R10-R14 R24 R30 R41 = rcl:R-EU_: RESISTOR, European symbol; SPICEPREFIX: R
R15-R23 = rcl-custom:R-EU_: RESISTOR, European symbol; SPICEPREFIX: R
T1 T2 = BSS138:BSS138: N-Channel 50V 220mA (Ta) 360mW (Ta) Surface Mount SOT-23-3 Check prices <https://pricing.snapeda.com/search/part/BSS138/?ref=eda>; AVAILABILITY: Good; DESCRIPTION: N-Channel 50V 220mA (Ta) 360mW (Ta) Surface Mount SOT-23-3; MF: ON Semiconductor; MP: BSS138; PACKAGE: SOT-23 ON Semiconductor; PRICE: None; PURCHASE-URL: https://pricing.snapeda.com/search/part/BSS138/?ref=eda
U1 = ESP32-WROOM-32:ESP32-WROOM-32: Check availability <https://pricing.snapeda.com/parts/ESP32-WROOM-32/Espressif%20Systems/view-part?ref=eda>; AVAILABILITY: In Stock; CHECK_PRICES: https://www.snapeda.com/parts/ESP32-WROOM-32/Espressif+Systems/view-part/?ref=eda; DESCRIPTION: Bluetooth, WiFi 802.11b/g/n, Bluetooth v4.2 +EDR, Class 1, 2 and 3 Transceiver Module 2.4GHz ~ 2.5GHz Antenna Not Included, U.FL Surface Mount; MF: Espressif Systems; MP: ESP32-WROOM-32; PACKAGE: None; PRICE: None; SNAPEDA_LINK: https://www.snapeda.com/parts/ESP32-WROOM-32/Espressif+Systems/view-part/?ref=snap
U2 U3 = MP1584EN-LF-Z:MP1584EN-LF-Z: The MP1584 is a high frequency step-down switching regulator with an integrated internal high-side high voltage power MOSFET. It provides 3A output with current mode control for fast loop response and easy compensation. The wide 4.5V to 28V input range accommodates a variety of step-down applications, including those in an automotive input environment. A 100µA operational quiescent current allows use in battery-powered applications. Check availability <https://pricing.snapeda.com/parts/MP1584EN-LF-Z/Monolithic%20Power/view-part?ref=eda>; AVAILABILITY: In Stock; CHECK_PRICES: https://www.snapeda.com/parts/MP1584EN-LF-Z/Monolithic+Power+Systems+Inc./view-part/?ref=eda; DESCRIPTION: Buck Switching Regulator IC Positive Adjustable 0.8V 1 Output 3A 8-SOIC (0.154, 3.90mm Width) Exposed Pad; MF: Monolithic Power; MP: MP1584EN-LF-Z; PACKAGE: SOIC-8 MPS; PRICE: None; PURCHASE-URL: https://www.snapeda.com/api/url_track_click_mouser/?unipart_id=587890&manufacturer=Monolithic Power&part_name=MP1584EN-LF-Z&search_term=mp158; SNAPEDA_LINK: https://www.snapeda.com/parts/MP1584EN-LF-Z/Monolithic+Power+Systems+Inc./view-part/?ref=snap
U$3 = ch340g:CH340G
U$4 U$5 = SRN6045-330M:SRN6045-330M: Check availability <https://pricing.snapeda.com/parts/SRN6045-330M/Bourns/view-part?ref=eda>; AVAILABILITY: In Stock; CHECK_PRICES: https://www.snapeda.com/parts/SRN6045-330M/Bourns/view-part/?ref=eda; DESCRIPTION: Inductor,Power,Semi-Shielded,Ind 33 uH,Tol 20%,Cur-Rtg 1.4 A,SMT | Bourns SRN6045-330M; MF: Bourns; MP: SRN6045-330M; PACKAGE: Nonstandard Bourns; PRICE: None; SNAPEDA_LINK: https://www.snapeda.com/parts/SRN6045-330M/Bourns/view-part/?ref=snap
X1 = SmartPrj:PN61729: BERG USB connector